# Altium schematic sheet usb-i2c-uart.SchDoc: Test
size A4; DrawnBy: Łukasz Przeniosło; Organization: Apptimia sp. z o.o.; Address1: Wojska Polskiego 184c/4; Address2: 71-256 Szczecin; Address3: www.apptimia.com; DocumentNumber: 5; Revision: 1; SheetNumber: 5; SheetTotal: 12
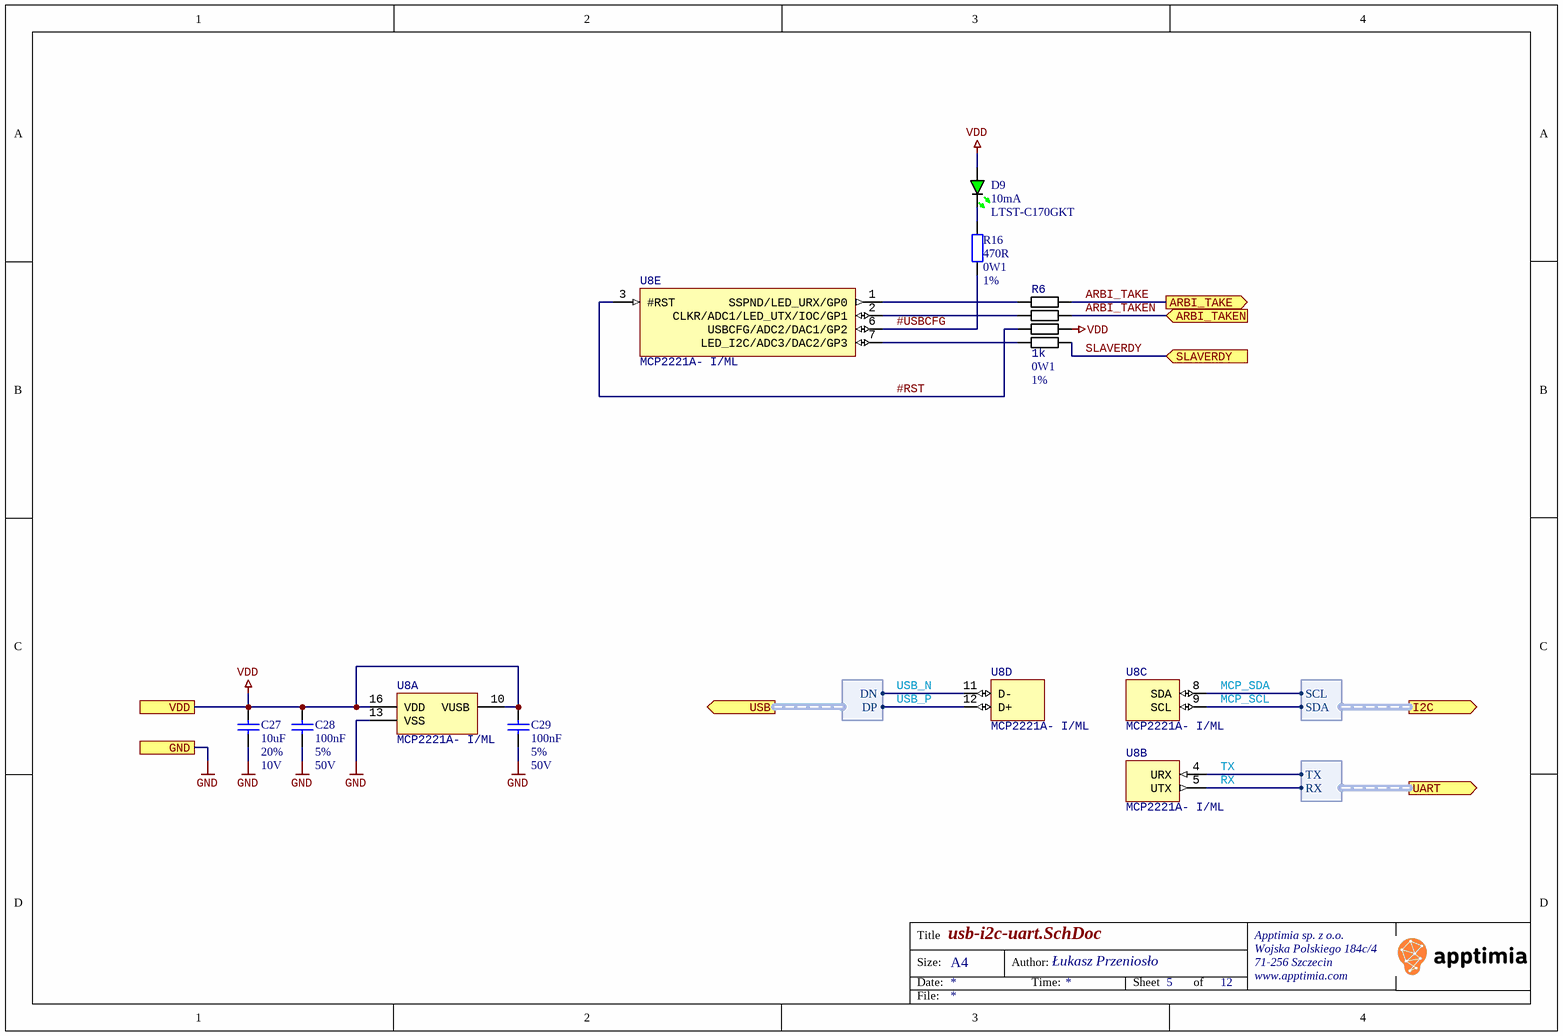
[diagram p0: usb-i2c-uart.SchDoc]

## Parts
C27  10uF  Tolerance: 20%  Voltage: 10V  [CAPC1608N]
C28  100nF  Tolerance: 5%  Voltage: 50V  [CAPC1608N]
C29  100nF  Tolerance: 5%  Voltage: 50V  [CAPC1608N]
D9  Current: 10mA  manid: LTST-C170GKT  [CD2012-0805-GRN]  (hidden comment: Led Green)
R6  1k  Power: 0W1  Tolerance: 1%  [RES_ARRAY_4x0603]
R16  470R  Power: 0W1  Tolerance: 1%  [RESC1608N]
U8  MCP2221A- I/ML  [QFN16_4x4]  (parts A,B,C,D,E of 5)

## Ports
ARBI_TAKE (out), ARBI_TAKEN (in), GND, I2C (out, harness I2C), SLAVERDY (in), UART (out, harness UART), USB (out, harness USB), VDD

## Harnesses
I2C: SCL, SDA
UART: RX, TX
USB: DN, DP

## Nets
GND: C27.1 C28.1 C29.1 U8.13(VSS) ; port GND
VDD: C27.2 C28.2 C29.2 D9.1(A) R6.4 U8.10(VUSB) U8.16(VDD) ; port VDD
#RST: R6.3 U8.3(#RST)
#USBCFG: R16.1 U8.6(USBCFG/ADC2/DAC1/GP2)
ARBI_TAKE: R6.8 ; port ARBI_TAKE
ARBI_TAKEN: R6.6 ; port ARBI_TAKEN
MCP_SCL: U8.9(SCL) ; port I2C.SDA
MCP_SDA: U8.8(SDA) ; port I2C.SCL
RX: U8.5(UTX) ; port UART.RX
SLAVERDY: R6.2 ; port SLAVERDY
TX: U8.4(URX) ; port UART.TX
USB_N: U8.11(D-) ; port USB.DN
USB_P: U8.12(D+) ; port USB.DP
NetD9_2: D9.2(K) R16.2
NetR6_1: R6.1 U8.7(LED_I2C/ADC3/DAC2/GP3)
NetR6_5: R6.5 U8.2(CLKR/ADC1/LED_UTX/IOC/GP1)
NetR6_7: R6.7 U8.1(SSPND/LED_URX/GP0)

Not connected (* = marked no-connect by the designer): U8 14(NC) 15(NC)

## Notes on the sheet
- Title
- Size:
- Date:
- A4
- Author:
- Time:
- Sheet
- of
- File:

## Library data of the parts
C27-C29 = Capacitor
  C27: Value: 10uF
  C28 C29: Value: 100nF
D9 = Led Green: Typical GRN LED
R6 = RES_ARRAY_1206: value: 1k
R16 = Resistor: Value: 470R
U8 = MCP2221A- I/ML: USB 2.0 to I2C/UART Protocol Converter with GPIO; manid: MCP2221A- I/ML